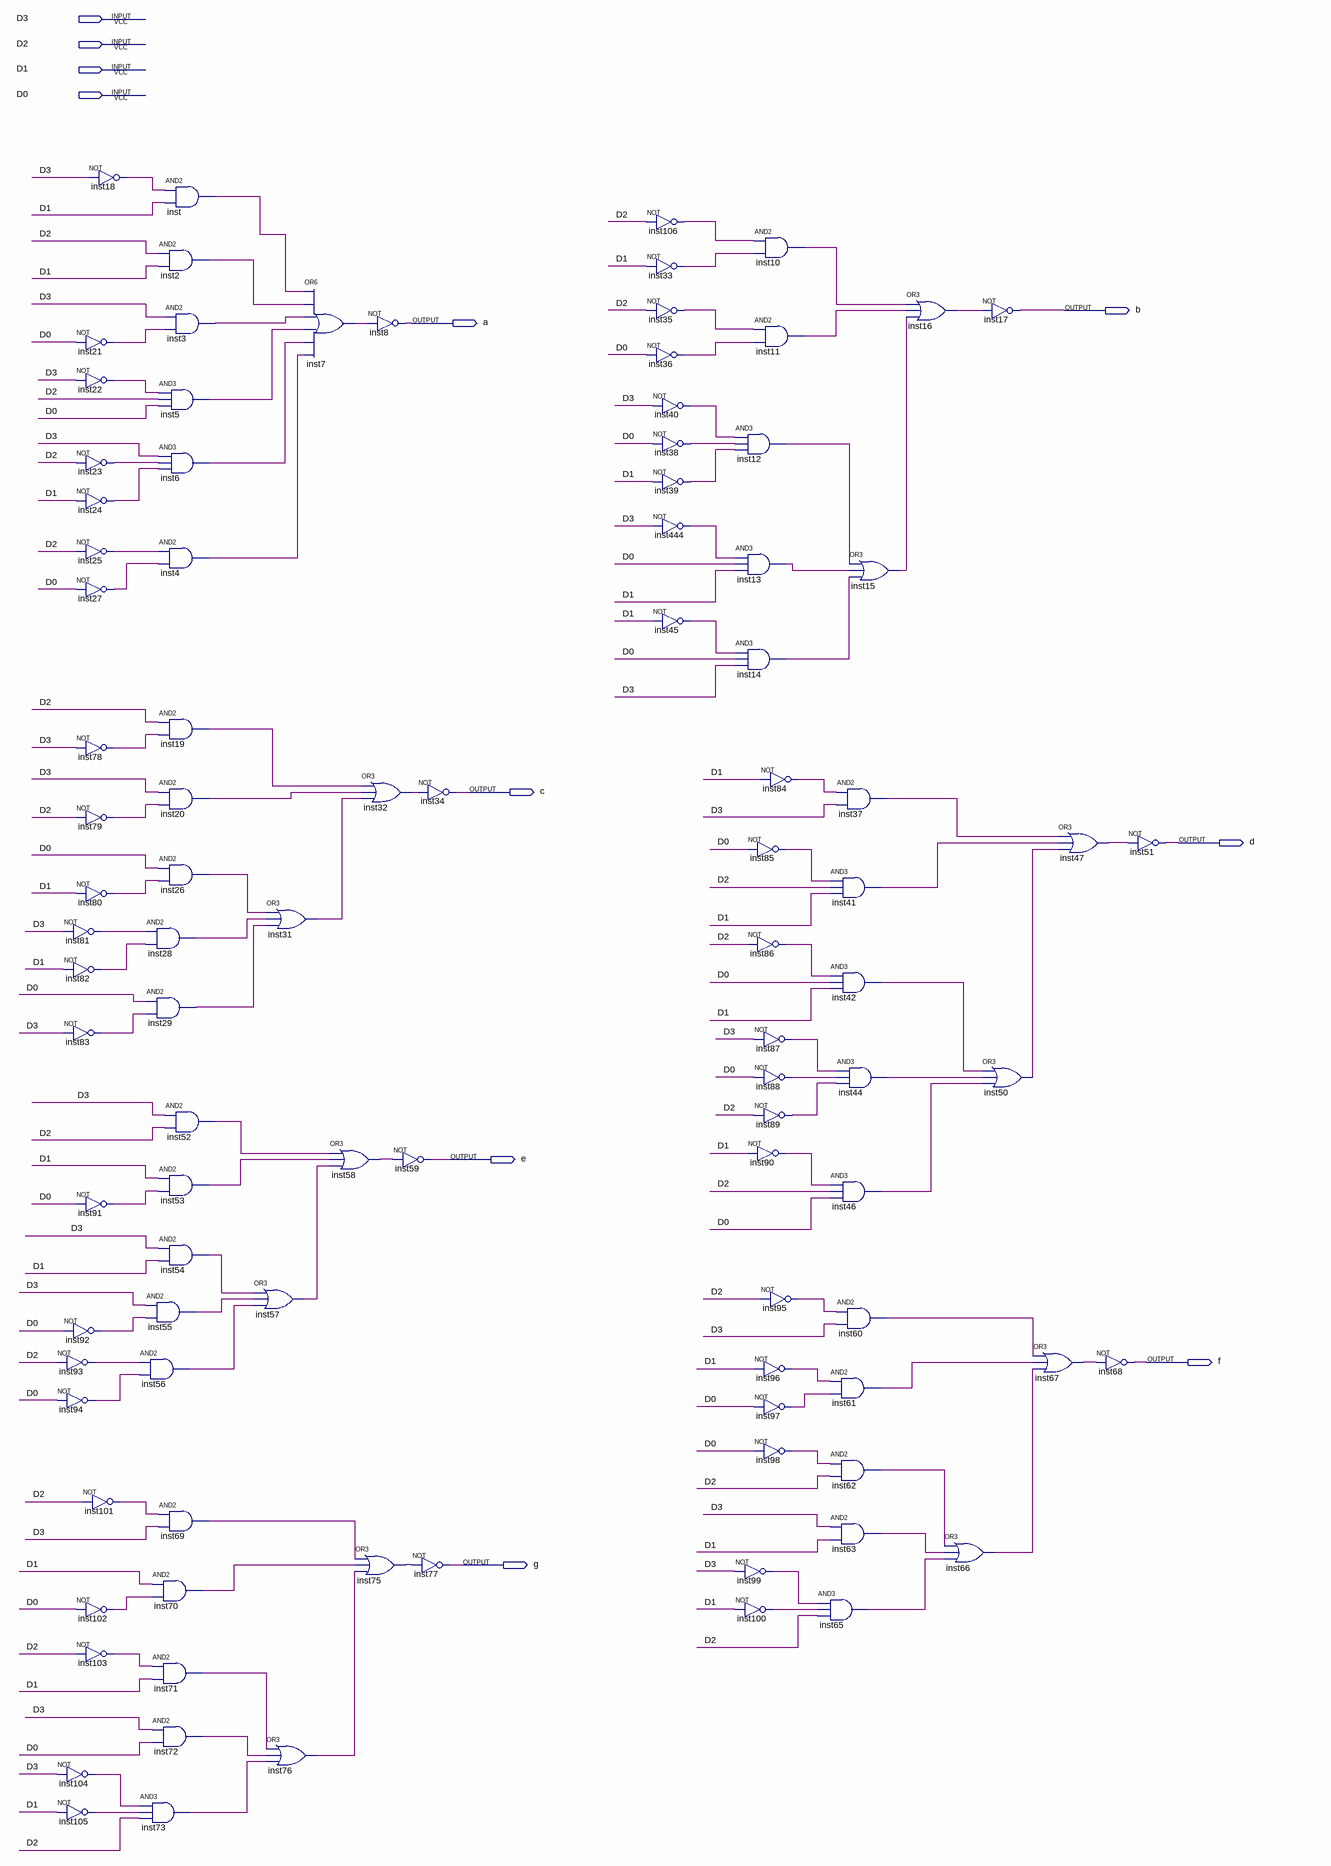
[diagram p0: schematic sheet]
// Quartus schematic display.bdf as structural Verilog: 100 symbols, 11 pins
module display (
  input  D3,
  input  D2,
  input  D1,
  input  D0,
  output b,
  output a,
  output c,
  output d,
  output e,
  output f,
  output g
);

  wire inst2_out, inst3_out, inst4_out, inst5_out, inst6_out, inst7_out, inst10_out, inst11_out, inst12_out,
       inst13_out, inst14_out, inst15_out, inst16_out, inst18_out, inst19_out, inst20_out, inst21_out,
       inst22_out, inst23_out, inst24_out, inst25_out, inst26_out, inst27_out, inst28_out, inst29_out,
       inst31_out, inst32_out, inst33_out, inst35_out, inst36_out, inst37_out, inst38_out, inst39_out,
       inst40_out, inst41_out, inst42_out, inst44_out, inst45_out, inst46_out, inst47_out, inst50_out,
       inst52_out, inst53_out, inst54_out, inst55_out, inst56_out, inst57_out, inst58_out, inst60_out,
       inst61_out, inst62_out, inst63_out, inst65_out, inst66_out, inst67_out, inst69_out, inst70_out,
       inst71_out, inst72_out, inst73_out, inst75_out, inst76_out, inst78_out, inst79_out, inst80_out,
       inst81_out, inst82_out, inst83_out, inst84_out, inst85_out, inst86_out, inst87_out, inst88_out,
       inst89_out, inst90_out, inst91_out, inst92_out, inst93_out, inst94_out, inst95_out, inst96_out,
       inst97_out, inst98_out, inst99_out, inst100_out, inst101_out, inst102_out, inst103_out, inst104_out,
       inst105_out, inst106_out, inst444_out, inst_out;

  not inst81 (inst81_out, D3);
  not inst82 (inst82_out, D1);
  not inst83 (inst83_out, D3);
  not inst92 (inst92_out, D0);
  not inst93 (inst93_out, D2);
  not inst94 (inst94_out, D0);
  not inst104 (inst104_out, D3);
  not inst105 (inst105_out, D1);
  not inst18 (inst18_out, D3);
  not inst21 (inst21_out, D0);
  not inst22 (inst22_out, D3);
  not inst23 (inst23_out, D2);
  not inst24 (inst24_out, D1);
  not inst25 (inst25_out, D2);
  not inst27 (inst27_out, D0);
  not inst78 (inst78_out, D3);
  not inst79 (inst79_out, D2);
  not inst80 (inst80_out, D1);
  not inst91 (inst91_out, D0);
  not inst101 (inst101_out, D2);
  not inst102 (inst102_out, D0);
  not inst103 (inst103_out, D2);
  and inst (inst_out, inst18_out, D1);
  and inst2 (inst2_out, D2, D1);
  and inst3 (inst3_out, D3, inst21_out);
  and inst5 (inst5_out, inst22_out, D2, D0);
  and inst6 (inst6_out, D3, inst23_out, inst24_out);
  and inst4 (inst4_out, inst25_out, inst27_out);
  and inst19 (inst19_out, D2, inst78_out);
  and inst20 (inst20_out, D3, inst79_out);
  and inst26 (inst26_out, D0, inst80_out);
  and inst28 (inst28_out, inst81_out, inst82_out);
  and inst29 (inst29_out, D0, inst83_out);
  and inst52 (inst52_out, D3, D2);
  and inst53 (inst53_out, D1, inst91_out);
  and inst54 (inst54_out, D3, D1);
  and inst55 (inst55_out, D3, inst92_out);
  and inst56 (inst56_out, inst93_out, inst94_out);
  and inst69 (inst69_out, inst101_out, D3);
  and inst70 (inst70_out, D1, inst102_out);
  and inst71 (inst71_out, inst103_out, D1);
  and inst72 (inst72_out, D3, D0);
  and inst73 (inst73_out, inst104_out, inst105_out, D2);
  or inst31 (inst31_out, inst26_out, inst28_out, inst29_out);
  or inst57 (inst57_out, inst54_out, inst55_out, inst56_out);
  or inst76 (inst76_out, inst71_out, inst72_out, inst73_out);
  or inst7 (inst7_out, inst_out, inst2_out, inst3_out, inst5_out, inst6_out, inst4_out);
  not inst8 (a, inst7_out);
  or inst32 (inst32_out, inst19_out, inst20_out, inst31_out);
  or inst58 (inst58_out, inst52_out, inst53_out, inst57_out);
  or inst75 (inst75_out, inst69_out, inst70_out, inst76_out);
  not inst34 (c, inst32_out);
  not inst59 (e, inst58_out);
  not inst77 (g, inst75_out);
  not inst106 (inst106_out, D2);
  not inst33 (inst33_out, D1);
  not inst35 (inst35_out, D2);
  not inst36 (inst36_out, D0);
  not inst40 (inst40_out, D3);
  not inst38 (inst38_out, D0);
  not inst39 (inst39_out, D1);
  not inst444 (inst444_out, D3);
  not inst45 (inst45_out, D1);
  and inst10 (inst10_out, inst106_out, inst33_out);
  and inst11 (inst11_out, inst35_out, inst36_out);
  and inst12 (inst12_out, inst40_out, inst38_out, inst39_out);
  and inst13 (inst13_out, inst444_out, D0, D1);
  and inst14 (inst14_out, inst45_out, D0, D3);
  not inst84 (inst84_out, D1);
  not inst85 (inst85_out, D0);
  not inst86 (inst86_out, D2);
  not inst87 (inst87_out, D3);
  not inst88 (inst88_out, D0);
  not inst89 (inst89_out, D2);
  not inst90 (inst90_out, D1);
  not inst95 (inst95_out, D2);
  not inst96 (inst96_out, D1);
  not inst97 (inst97_out, D0);
  not inst98 (inst98_out, D0);
  not inst99 (inst99_out, D3);
  not inst100 (inst100_out, D1);
  and inst41 (inst41_out, inst85_out, D2, D1);
  and inst42 (inst42_out, inst86_out, D0, D1);
  and inst46 (inst46_out, inst90_out, D2, D0);
  and inst61 (inst61_out, inst96_out, inst97_out);
  and inst62 (inst62_out, inst98_out, D2);
  and inst63 (inst63_out, D3, D1);
  and inst65 (inst65_out, inst99_out, inst100_out, D2);
  or inst15 (inst15_out, inst12_out, inst13_out, inst14_out);
  and inst37 (inst37_out, inst84_out, D3);
  and inst44 (inst44_out, inst87_out, inst88_out, inst89_out);
  and inst60 (inst60_out, inst95_out, D3);
  or inst16 (inst16_out, inst10_out, inst11_out, inst15_out);
  not inst17 (b, inst16_out);
  or inst50 (inst50_out, inst42_out, inst44_out, inst46_out);
  or inst66 (inst66_out, inst62_out, inst63_out, inst65_out);
  or inst67 (inst67_out, inst60_out, inst61_out, inst66_out);
  or inst47 (inst47_out, inst37_out, inst41_out, inst50_out);
  not inst51 (d, inst47_out);
  not inst68 (f, inst67_out);
endmodule
